# Altium schematic sheet RELAYS.SchDoc
size 594 x 420 mm
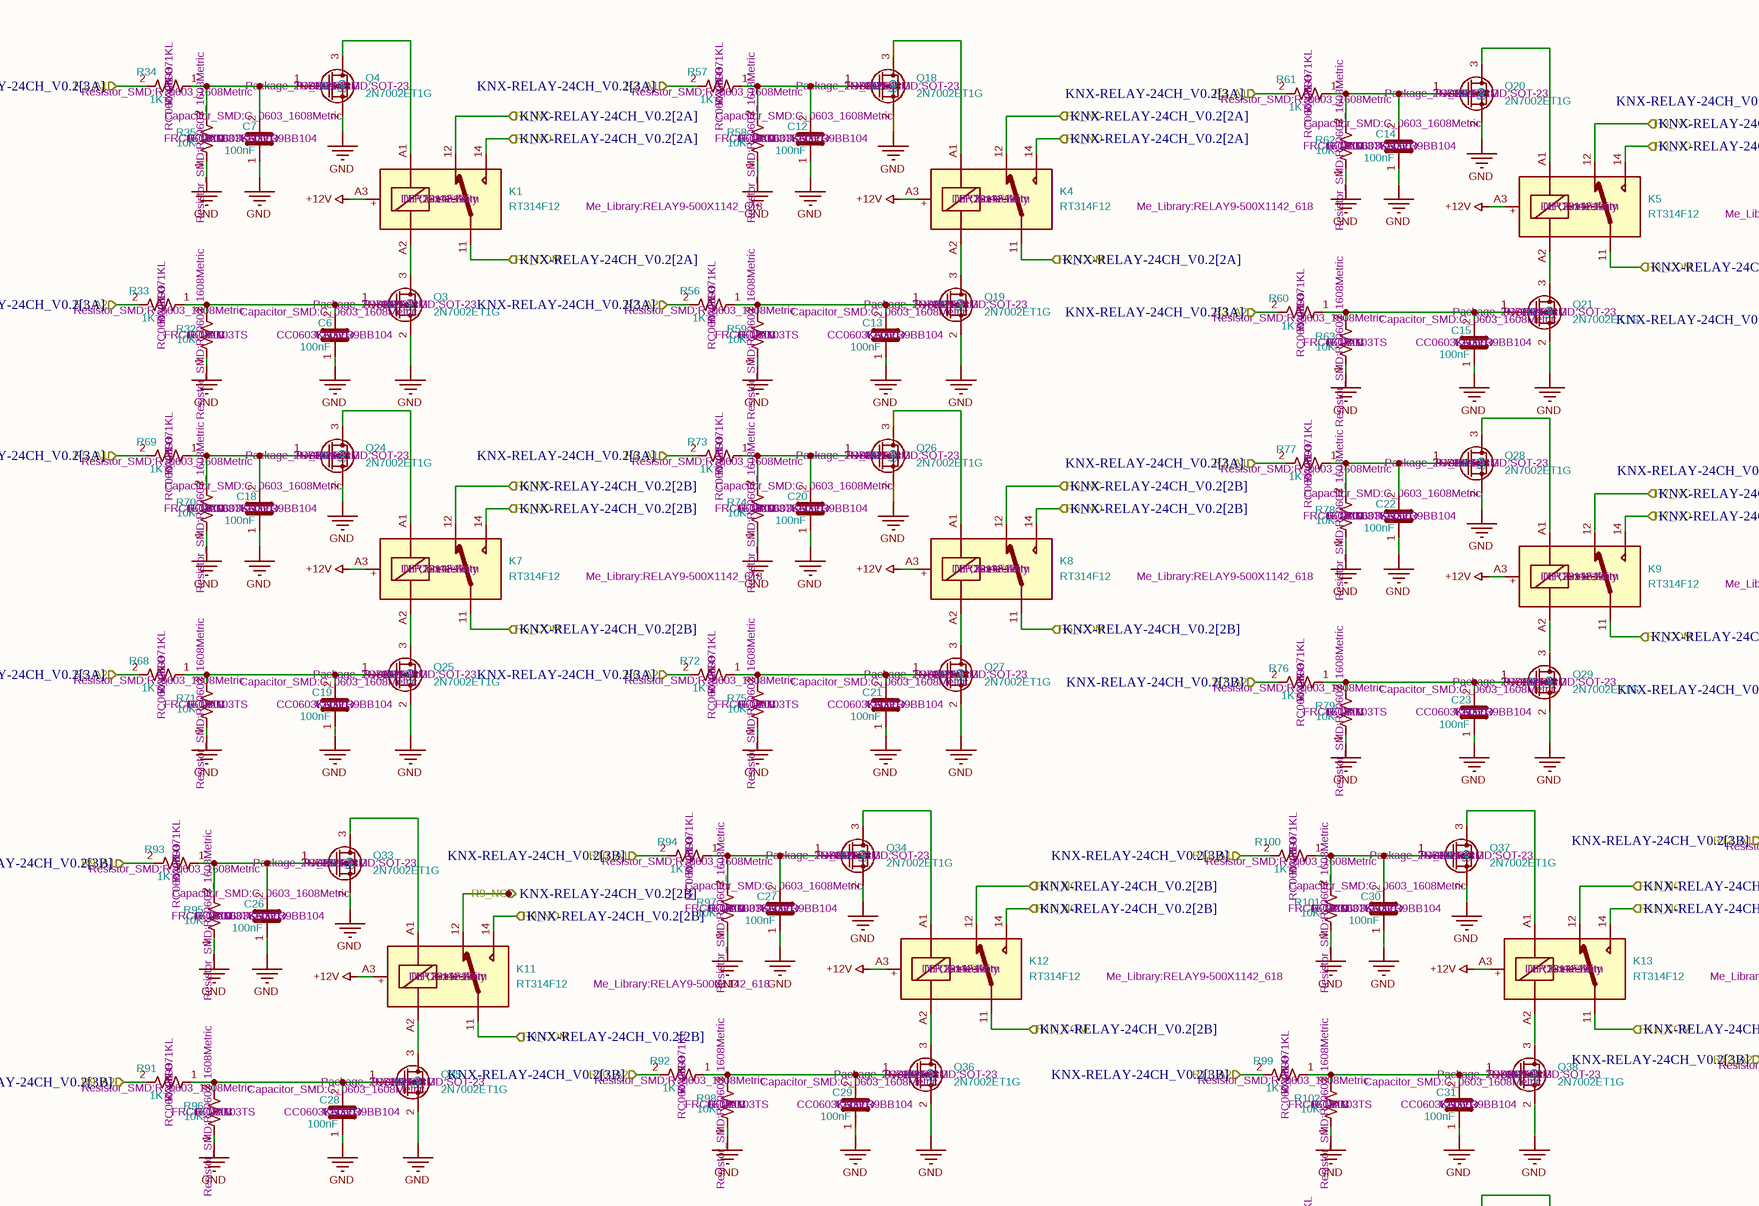
[diagram p0: RELAYS.SchDoc, top left]
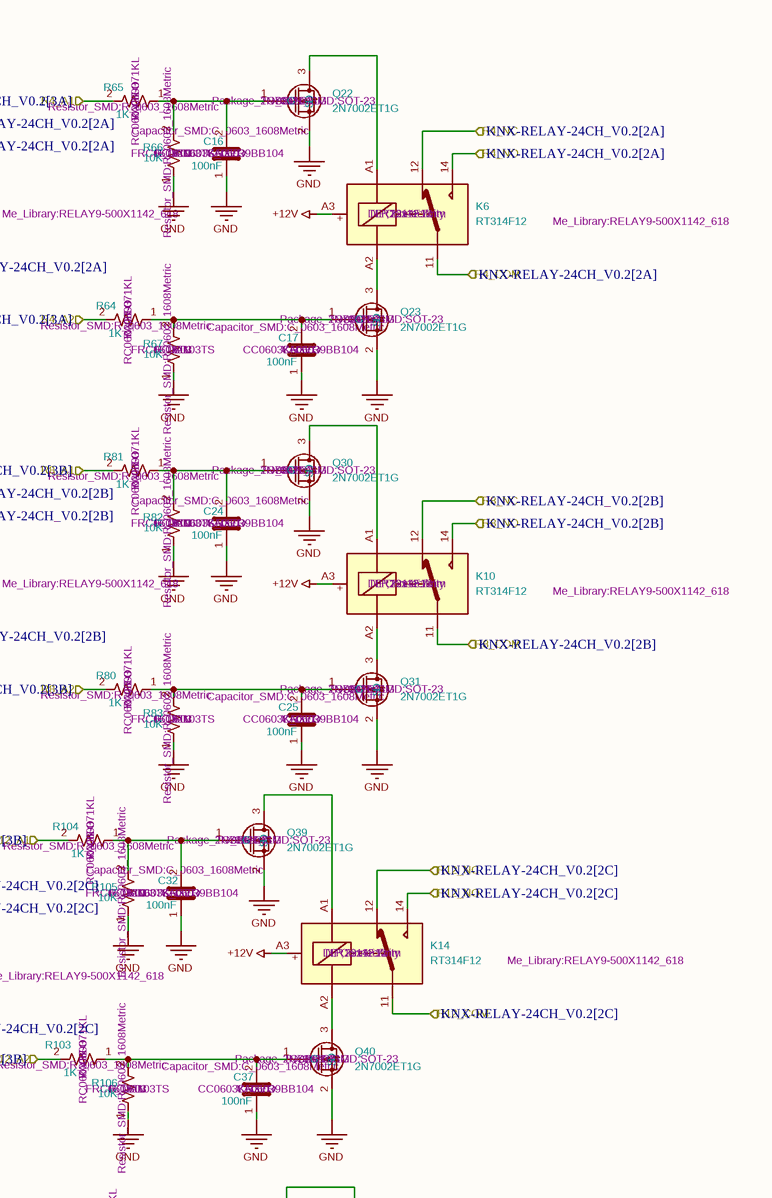
[diagram p1: RELAYS.SchDoc, top right]
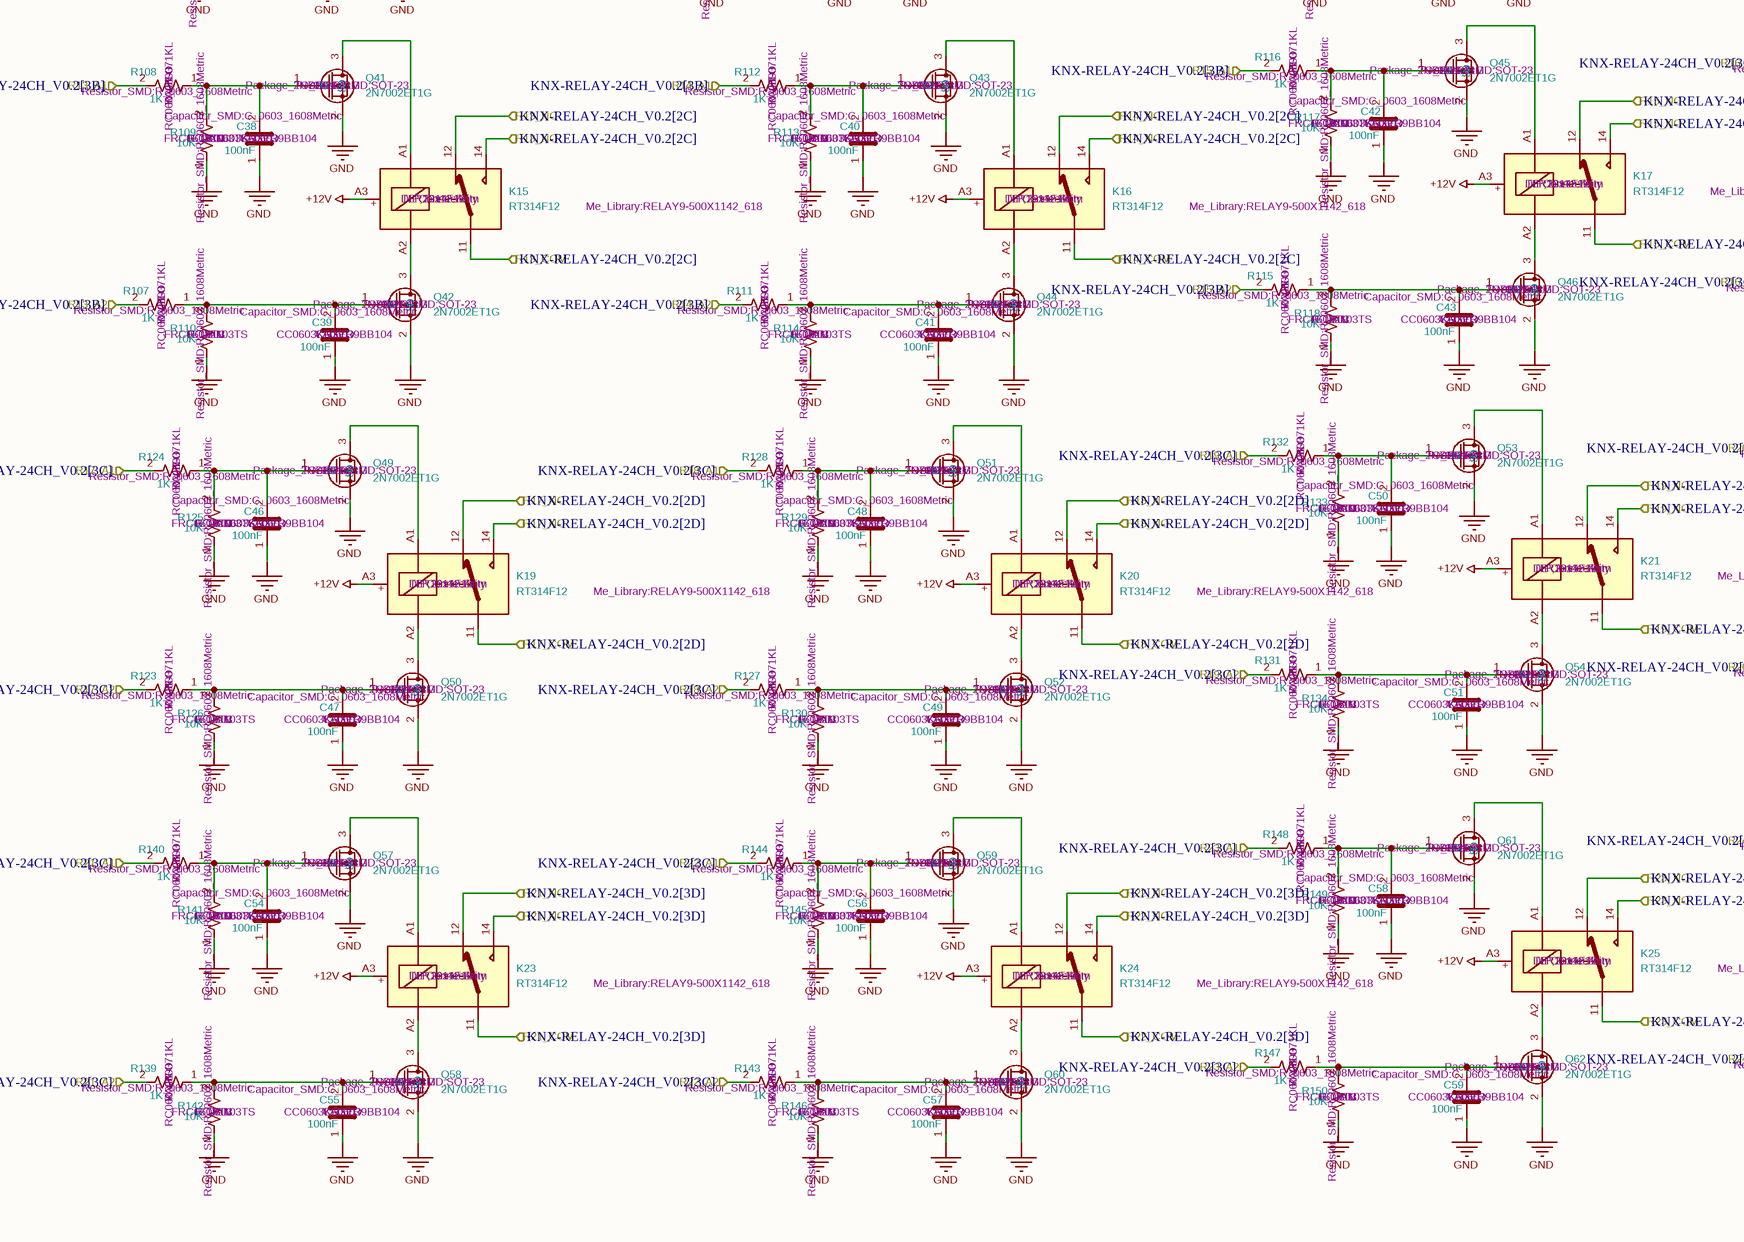
[diagram p2: RELAYS.SchDoc, bottom left]
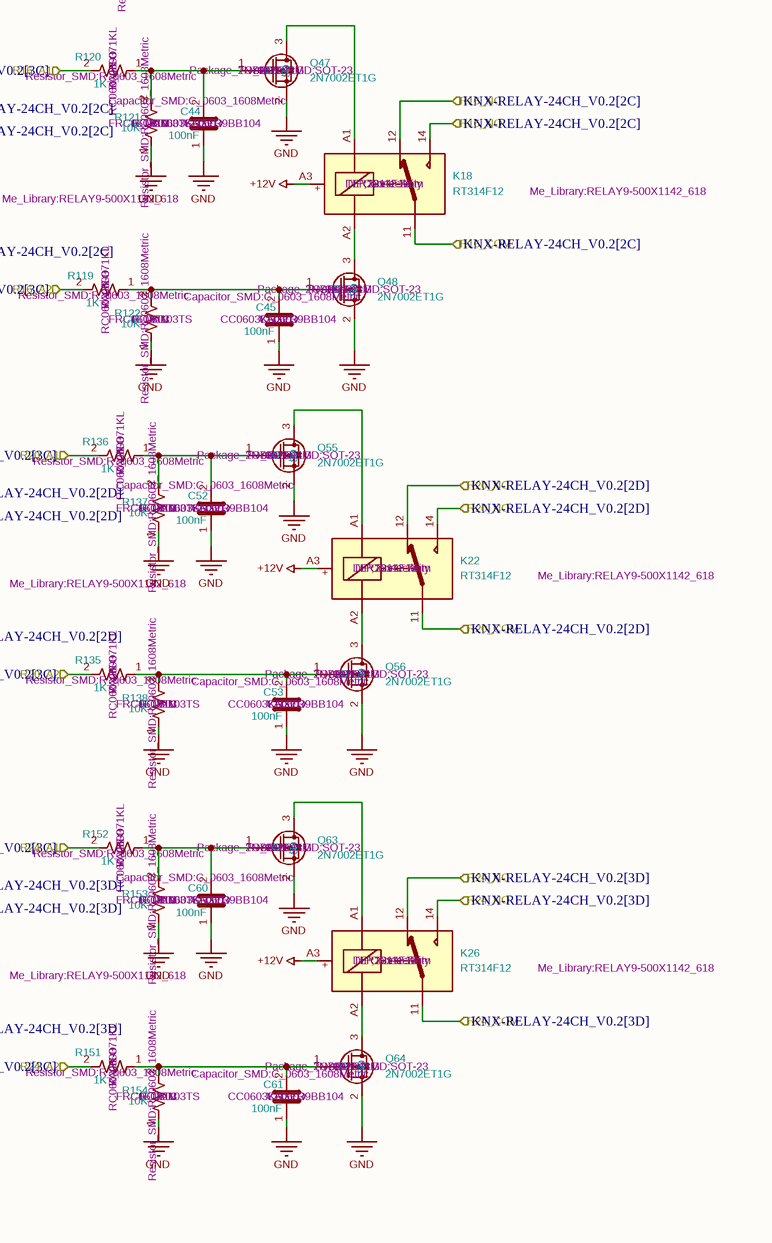
[diagram p3: RELAYS.SchDoc, bottom right]

## Parts
C6  Manufacturer Part Number: CC0603KRX7R9BB104  Manufacturer: YAGEO  Package: C_0603  Footprint: Capacitor_SMD:C_0603_1608Metric  [C_0603_1608Metric]  (hidden comment: 100nF)
C7  Manufacturer Part Number: CC0603KRX7R9BB104  Manufacturer: YAGEO  Package: C_0603  Footprint: Capacitor_SMD:C_0603_1608Metric  [C_0603_1608Metric]  (hidden comment: 100nF)
C12  Manufacturer Part Number: CC0603KRX7R9BB104  Manufacturer: YAGEO  Package: C_0603  Footprint: Capacitor_SMD:C_0603_1608Metric  [C_0603_1608Metric]  (hidden comment: 100nF)
C13  Manufacturer Part Number: CC0603KRX7R9BB104  Manufacturer: YAGEO  Package: C_0603  Footprint: Capacitor_SMD:C_0603_1608Metric  [C_0603_1608Metric]  (hidden comment: 100nF)
C14  Manufacturer Part Number: CC0603KRX7R9BB104  Manufacturer: YAGEO  Package: C_0603  Footprint: Capacitor_SMD:C_0603_1608Metric  [C_0603_1608Metric]  (hidden comment: 100nF)
C15  Manufacturer Part Number: CC0603KRX7R9BB104  Manufacturer: YAGEO  Package: C_0603  Footprint: Capacitor_SMD:C_0603_1608Metric  [C_0603_1608Metric]  (hidden comment: 100nF)
C16  Manufacturer Part Number: CC0603KRX7R9BB104  Manufacturer: YAGEO  Package: C_0603  Footprint: Capacitor_SMD:C_0603_1608Metric  [C_0603_1608Metric]  (hidden comment: 100nF)
C17  Manufacturer Part Number: CC0603KRX7R9BB104  Manufacturer: YAGEO  Package: C_0603  Footprint: Capacitor_SMD:C_0603_1608Metric  [C_0603_1608Metric]  (hidden comment: 100nF)
C18  Manufacturer Part Number: CC0603KRX7R9BB104  Manufacturer: YAGEO  Package: C_0603  Footprint: Capacitor_SMD:C_0603_1608Metric  [C_0603_1608Metric]  (hidden comment: 100nF)
C19  Manufacturer Part Number: CC0603KRX7R9BB104  Manufacturer: YAGEO  Package: C_0603  Footprint: Capacitor_SMD:C_0603_1608Metric  [C_0603_1608Metric]  (hidden comment: 100nF)
C20  Manufacturer Part Number: CC0603KRX7R9BB104  Manufacturer: YAGEO  Package: C_0603  Footprint: Capacitor_SMD:C_0603_1608Metric  [C_0603_1608Metric]  (hidden comment: 100nF)
C21  Manufacturer Part Number: CC0603KRX7R9BB104  Manufacturer: YAGEO  Package: C_0603  Footprint: Capacitor_SMD:C_0603_1608Metric  [C_0603_1608Metric]  (hidden comment: 100nF)
C22  Manufacturer Part Number: CC0603KRX7R9BB104  Manufacturer: YAGEO  Package: C_0603  Footprint: Capacitor_SMD:C_0603_1608Metric  [C_0603_1608Metric]  (hidden comment: 100nF)
C23  Manufacturer Part Number: CC0603KRX7R9BB104  Manufacturer: YAGEO  Package: C_0603  Footprint: Capacitor_SMD:C_0603_1608Metric  [C_0603_1608Metric]  (hidden comment: 100nF)
C24  Manufacturer Part Number: CC0603KRX7R9BB104  Manufacturer: YAGEO  Package: C_0603  Footprint: Capacitor_SMD:C_0603_1608Metric  [C_0603_1608Metric]  (hidden comment: 100nF)
C25  Manufacturer Part Number: CC0603KRX7R9BB104  Manufacturer: YAGEO  Package: C_0603  Footprint: Capacitor_SMD:C_0603_1608Metric  [C_0603_1608Metric]  (hidden comment: 100nF)
C26  Manufacturer Part Number: CC0603KRX7R9BB104  Manufacturer: YAGEO  Package: C_0603  Footprint: Capacitor_SMD:C_0603_1608Metric  [C_0603_1608Metric]  (hidden comment: 100nF)
C27  Manufacturer Part Number: CC0603KRX7R9BB104  Manufacturer: YAGEO  Package: C_0603  Footprint: Capacitor_SMD:C_0603_1608Metric  [C_0603_1608Metric]  (hidden comment: 100nF)
C28  Manufacturer Part Number: CC0603KRX7R9BB104  Manufacturer: YAGEO  Package: C_0603  Footprint: Capacitor_SMD:C_0603_1608Metric  [C_0603_1608Metric]  (hidden comment: 100nF)
C29  Manufacturer Part Number: CC0603KRX7R9BB104  Manufacturer: YAGEO  Package: C_0603  Footprint: Capacitor_SMD:C_0603_1608Metric  [C_0603_1608Metric]  (hidden comment: 100nF)
C30  Manufacturer Part Number: CC0603KRX7R9BB104  Manufacturer: YAGEO  Package: C_0603  Footprint: Capacitor_SMD:C_0603_1608Metric  [C_0603_1608Metric]  (hidden comment: 100nF)
C31  Manufacturer Part Number: CC0603KRX7R9BB104  Manufacturer: YAGEO  Package: C_0603  Footprint: Capacitor_SMD:C_0603_1608Metric  [C_0603_1608Metric]  (hidden comment: 100nF)
C32  Manufacturer Part Number: CC0603KRX7R9BB104  Manufacturer: YAGEO  Package: C_0603  Footprint: Capacitor_SMD:C_0603_1608Metric  [C_0603_1608Metric]  (hidden comment: 100nF)
C37  Manufacturer Part Number: CC0603KRX7R9BB104  Manufacturer: YAGEO  Package: C_0603  Footprint: Capacitor_SMD:C_0603_1608Metric  [C_0603_1608Metric]  (hidden comment: 100nF)
C38  Manufacturer Part Number: CC0603KRX7R9BB104  Manufacturer: YAGEO  Package: C_0603  Footprint: Capacitor_SMD:C_0603_1608Metric  [C_0603_1608Metric]  (hidden comment: 100nF)
C39  Manufacturer Part Number: CC0603KRX7R9BB104  Manufacturer: YAGEO  Package: C_0603  Footprint: Capacitor_SMD:C_0603_1608Metric  [C_0603_1608Metric]  (hidden comment: 100nF)
C40  Manufacturer Part Number: CC0603KRX7R9BB104  Manufacturer: YAGEO  Package: C_0603  Footprint: Capacitor_SMD:C_0603_1608Metric  [C_0603_1608Metric]  (hidden comment: 100nF)
C41  Manufacturer Part Number: CC0603KRX7R9BB104  Manufacturer: YAGEO  Package: C_0603  Footprint: Capacitor_SMD:C_0603_1608Metric  [C_0603_1608Metric]  (hidden comment: 100nF)
C42  Manufacturer Part Number: CC0603KRX7R9BB104  Manufacturer: YAGEO  Package: C_0603  Footprint: Capacitor_SMD:C_0603_1608Metric  [C_0603_1608Metric]  (hidden comment: 100nF)
C43  Manufacturer Part Number: CC0603KRX7R9BB104  Manufacturer: YAGEO  Package: C_0603  Footprint: Capacitor_SMD:C_0603_1608Metric  [C_0603_1608Metric]  (hidden comment: 100nF)
C44  Manufacturer Part Number: CC0603KRX7R9BB104  Manufacturer: YAGEO  Package: C_0603  Footprint: Capacitor_SMD:C_0603_1608Metric  [C_0603_1608Metric]  (hidden comment: 100nF)
C45  Manufacturer Part Number: CC0603KRX7R9BB104  Manufacturer: YAGEO  Package: C_0603  Footprint: Capacitor_SMD:C_0603_1608Metric  [C_0603_1608Metric]  (hidden comment: 100nF)
C46  Manufacturer Part Number: CC0603KRX7R9BB104  Manufacturer: YAGEO  Package: C_0603  Footprint: Capacitor_SMD:C_0603_1608Metric  [C_0603_1608Metric]  (hidden comment: 100nF)
C47  Manufacturer Part Number: CC0603KRX7R9BB104  Manufacturer: YAGEO  Package: C_0603  Footprint: Capacitor_SMD:C_0603_1608Metric  [C_0603_1608Metric]  (hidden comment: 100nF)
C48  Manufacturer Part Number: CC0603KRX7R9BB104  Manufacturer: YAGEO  Package: C_0603  Footprint: Capacitor_SMD:C_0603_1608Metric  [C_0603_1608Metric]  (hidden comment: 100nF)
C49  Manufacturer Part Number: CC0603KRX7R9BB104  Manufacturer: YAGEO  Package: C_0603  Footprint: Capacitor_SMD:C_0603_1608Metric  [C_0603_1608Metric]  (hidden comment: 100nF)
C50  Manufacturer Part Number: CC0603KRX7R9BB104  Manufacturer: YAGEO  Package: C_0603  Footprint: Capacitor_SMD:C_0603_1608Metric  [C_0603_1608Metric]  (hidden comment: 100nF)
C51  Manufacturer Part Number: CC0603KRX7R9BB104  Manufacturer: YAGEO  Package: C_0603  Footprint: Capacitor_SMD:C_0603_1608Metric  [C_0603_1608Metric]  (hidden comment: 100nF)
C52  Manufacturer Part Number: CC0603KRX7R9BB104  Manufacturer: YAGEO  Package: C_0603  Footprint: Capacitor_SMD:C_0603_1608Metric  [C_0603_1608Metric]  (hidden comment: 100nF)
C53  Manufacturer Part Number: CC0603KRX7R9BB104  Manufacturer: YAGEO  Package: C_0603  Footprint: Capacitor_SMD:C_0603_1608Metric  [C_0603_1608Metric]  (hidden comment: 100nF)
C54  Manufacturer Part Number: CC0603KRX7R9BB104  Manufacturer: YAGEO  Package: C_0603  Footprint: Capacitor_SMD:C_0603_1608Metric  [C_0603_1608Metric]  (hidden comment: 100nF)
C55  Manufacturer Part Number: CC0603KRX7R9BB104  Manufacturer: YAGEO  Package: C_0603  Footprint: Capacitor_SMD:C_0603_1608Metric  [C_0603_1608Metric]  (hidden comment: 100nF)
C56  Manufacturer Part Number: CC0603KRX7R9BB104  Manufacturer: YAGEO  Package: C_0603  Footprint: Capacitor_SMD:C_0603_1608Metric  [C_0603_1608Metric]  (hidden comment: 100nF)
C57  Manufacturer Part Number: CC0603KRX7R9BB104  Manufacturer: YAGEO  Package: C_0603  Footprint: Capacitor_SMD:C_0603_1608Metric  [C_0603_1608Metric]  (hidden comment: 100nF)
C58  Manufacturer Part Number: CC0603KRX7R9BB104  Manufacturer: YAGEO  Package: C_0603  Footprint: Capacitor_SMD:C_0603_1608Metric  [C_0603_1608Metric]  (hidden comment: 100nF)
C59  Manufacturer Part Number: CC0603KRX7R9BB104  Manufacturer: YAGEO  Package: C_0603  Footprint: Capacitor_SMD:C_0603_1608Metric  [C_0603_1608Metric]  (hidden comment: 100nF)
C60  Manufacturer Part Number: CC0603KRX7R9BB104  Manufacturer: YAGEO  Package: C_0603  Footprint: Capacitor_SMD:C_0603_1608Metric  [C_0603_1608Metric]  (hidden comment: 100nF)
C61  Manufacturer Part Number: CC0603KRX7R9BB104  Manufacturer: YAGEO  Package: C_0603  Footprint: Capacitor_SMD:C_0603_1608Metric  [C_0603_1608Metric]  (hidden comment: 100nF)
K1  Manufacturer: TE Connectivity  Package: DIP,29x12.7mm  Footprint: Me_Library:RELAY9-500X1142_618  [RELAY9-500X1142_618]  (hidden comment: RT314F12)
K4  Manufacturer: TE Connectivity  Package: DIP,29x12.7mm  Footprint: Me_Library:RELAY9-500X1142_618  [RELAY9-500X1142_618]  (hidden comment: RT314F12)
K5  Manufacturer: TE Connectivity  Package: DIP,29x12.7mm  Footprint: Me_Library:RELAY9-500X1142_618  [RELAY9-500X1142_618]  (hidden comment: RT314F12)
K6  Manufacturer: TE Connectivity  Package: DIP,29x12.7mm  Footprint: Me_Library:RELAY9-500X1142_618  [RELAY9-500X1142_618]  (hidden comment: RT314F12)
K7  Manufacturer: TE Connectivity  Package: DIP,29x12.7mm  Footprint: Me_Library:RELAY9-500X1142_618  [RELAY9-500X1142_618]  (hidden comment: RT314F12)
K8  Manufacturer: TE Connectivity  Package: DIP,29x12.7mm  Footprint: Me_Library:RELAY9-500X1142_618  [RELAY9-500X1142_618]  (hidden comment: RT314F12)
K9  Manufacturer: TE Connectivity  Package: DIP,29x12.7mm  Footprint: Me_Library:RELAY9-500X1142_618  [RELAY9-500X1142_618]  (hidden comment: RT314F12)
K10  Manufacturer: TE Connectivity  Package: DIP,29x12.7mm  Footprint: Me_Library:RELAY9-500X1142_618  [RELAY9-500X1142_618]  (hidden comment: RT314F12)
K11  Manufacturer: TE Connectivity  Package: DIP,29x12.7mm  Footprint: Me_Library:RELAY9-500X1142_618  [RELAY9-500X1142_618]  (hidden comment: RT314F12)
K12  Manufacturer: TE Connectivity  Package: DIP,29x12.7mm  Footprint: Me_Library:RELAY9-500X1142_618  [RELAY9-500X1142_618]  (hidden comment: RT314F12)
K13  Manufacturer: TE Connectivity  Package: DIP,29x12.7mm  Footprint: Me_Library:RELAY9-500X1142_618  [RELAY9-500X1142_618]  (hidden comment: RT314F12)
K14  Manufacturer: TE Connectivity  Package: DIP,29x12.7mm  Footprint: Me_Library:RELAY9-500X1142_618  [RELAY9-500X1142_618]  (hidden comment: RT314F12)
K15  Manufacturer: TE Connectivity  Package: DIP,29x12.7mm  Footprint: Me_Library:RELAY9-500X1142_618  [RELAY9-500X1142_618]  (hidden comment: RT314F12)
K16  Manufacturer: TE Connectivity  Package: DIP,29x12.7mm  Footprint: Me_Library:RELAY9-500X1142_618  [RELAY9-500X1142_618]  (hidden comment: RT314F12)
K17  Manufacturer: TE Connectivity  Package: DIP,29x12.7mm  Footprint: Me_Library:RELAY9-500X1142_618  [RELAY9-500X1142_618]  (hidden comment: RT314F12)
K18  Manufacturer: TE Connectivity  Package: DIP,29x12.7mm  Footprint: Me_Library:RELAY9-500X1142_618  [RELAY9-500X1142_618]  (hidden comment: RT314F12)
K19  Manufacturer: TE Connectivity  Package: DIP,29x12.7mm  Footprint: Me_Library:RELAY9-500X1142_618  [RELAY9-500X1142_618]  (hidden comment: RT314F12)
K20  Manufacturer: TE Connectivity  Package: DIP,29x12.7mm  Footprint: Me_Library:RELAY9-500X1142_618  [RELAY9-500X1142_618]  (hidden comment: RT314F12)
K21  Manufacturer: TE Connectivity  Package: DIP,29x12.7mm  Footprint: Me_Library:RELAY9-500X1142_618  [RELAY9-500X1142_618]  (hidden comment: RT314F12)
K22  Manufacturer: TE Connectivity  Package: DIP,29x12.7mm  Footprint: Me_Library:RELAY9-500X1142_618  [RELAY9-500X1142_618]  (hidden comment: RT314F12)
K23  Manufacturer: TE Connectivity  Package: DIP,29x12.7mm  Footprint: Me_Library:RELAY9-500X1142_618  [RELAY9-500X1142_618]  (hidden comment: RT314F12)
K24  Manufacturer: TE Connectivity  Package: DIP,29x12.7mm  Footprint: Me_Library:RELAY9-500X1142_618  [RELAY9-500X1142_618]  (hidden comment: RT314F12)
K25  Manufacturer: TE Connectivity  Package: DIP,29x12.7mm  Footprint: Me_Library:RELAY9-500X1142_618  [RELAY9-500X1142_618]  (hidden comment: RT314F12)
K26  Manufacturer: TE Connectivity  Package: DIP,29x12.7mm  Footprint: Me_Library:RELAY9-500X1142_618  [RELAY9-500X1142_618]  (hidden comment: RT314F12)
Q3  Manufacturer: onsemi  Footprint: Package_TO_SOT_SMD:SOT-23  [SOT-23]  (hidden comment: 2N7002ET1G)
Q4  Manufacturer: onsemi  Footprint: Package_TO_SOT_SMD:SOT-23  [SOT-23]  (hidden comment: 2N7002ET1G)
Q18  Manufacturer: onsemi  Footprint: Package_TO_SOT_SMD:SOT-23  [SOT-23]  (hidden comment: 2N7002ET1G)
Q19  Manufacturer: onsemi  Footprint: Package_TO_SOT_SMD:SOT-23  [SOT-23]  (hidden comment: 2N7002ET1G)
Q20  Manufacturer: onsemi  Footprint: Package_TO_SOT_SMD:SOT-23  [SOT-23]  (hidden comment: 2N7002ET1G)
Q21  Manufacturer: onsemi  Footprint: Package_TO_SOT_SMD:SOT-23  [SOT-23]  (hidden comment: 2N7002ET1G)
Q22  Manufacturer: onsemi  Footprint: Package_TO_SOT_SMD:SOT-23  [SOT-23]  (hidden comment: 2N7002ET1G)
Q23  Manufacturer: onsemi  Footprint: Package_TO_SOT_SMD:SOT-23  [SOT-23]  (hidden comment: 2N7002ET1G)
Q24  Manufacturer: onsemi  Footprint: Package_TO_SOT_SMD:SOT-23  [SOT-23]  (hidden comment: 2N7002ET1G)
Q25  Manufacturer: onsemi  Footprint: Package_TO_SOT_SMD:SOT-23  [SOT-23]  (hidden comment: 2N7002ET1G)
Q26  Manufacturer: onsemi  Footprint: Package_TO_SOT_SMD:SOT-23  [SOT-23]  (hidden comment: 2N7002ET1G)
Q27  Manufacturer: onsemi  Footprint: Package_TO_SOT_SMD:SOT-23  [SOT-23]  (hidden comment: 2N7002ET1G)
Q28  Manufacturer: onsemi  Footprint: Package_TO_SOT_SMD:SOT-23  [SOT-23]  (hidden comment: 2N7002ET1G)
Q29  Manufacturer: onsemi  Footprint: Package_TO_SOT_SMD:SOT-23  [SOT-23]  (hidden comment: 2N7002ET1G)
Q30  Manufacturer: onsemi  Footprint: Package_TO_SOT_SMD:SOT-23  [SOT-23]  (hidden comment: 2N7002ET1G)
Q31  Manufacturer: onsemi  Footprint: Package_TO_SOT_SMD:SOT-23  [SOT-23]  (hidden comment: 2N7002ET1G)
Q33  Manufacturer: onsemi  Footprint: Package_TO_SOT_SMD:SOT-23  [SOT-23]  (hidden comment: 2N7002ET1G)
Q34  Manufacturer: onsemi  Footprint: Package_TO_SOT_SMD:SOT-23  [SOT-23]  (hidden comment: 2N7002ET1G)
Q35  Manufacturer: onsemi  Footprint: Package_TO_SOT_SMD:SOT-23  [SOT-23]  (hidden comment: 2N7002ET1G)
Q36  Manufacturer: onsemi  Footprint: Package_TO_SOT_SMD:SOT-23  [SOT-23]  (hidden comment: 2N7002ET1G)
Q37  Manufacturer: onsemi  Footprint: Package_TO_SOT_SMD:SOT-23  [SOT-23]  (hidden comment: 2N7002ET1G)
Q38  Manufacturer: onsemi  Footprint: Package_TO_SOT_SMD:SOT-23  [SOT-23]  (hidden comment: 2N7002ET1G)
Q39  Manufacturer: onsemi  Footprint: Package_TO_SOT_SMD:SOT-23  [SOT-23]  (hidden comment: 2N7002ET1G)
Q40  Manufacturer: onsemi  Footprint: Package_TO_SOT_SMD:SOT-23  [SOT-23]  (hidden comment: 2N7002ET1G)
Q41  Manufacturer: onsemi  Footprint: Package_TO_SOT_SMD:SOT-23  [SOT-23]  (hidden comment: 2N7002ET1G)
Q42  Manufacturer: onsemi  Footprint: Package_TO_SOT_SMD:SOT-23  [SOT-23]  (hidden comment: 2N7002ET1G)
Q43  Manufacturer: onsemi  Footprint: Package_TO_SOT_SMD:SOT-23  [SOT-23]  (hidden comment: 2N7002ET1G)
Q44  Manufacturer: onsemi  Footprint: Package_TO_SOT_SMD:SOT-23  [SOT-23]  (hidden comment: 2N7002ET1G)
Q45  Manufacturer: onsemi  Footprint: Package_TO_SOT_SMD:SOT-23  [SOT-23]  (hidden comment: 2N7002ET1G)
Q46  Manufacturer: onsemi  Footprint: Package_TO_SOT_SMD:SOT-23  [SOT-23]  (hidden comment: 2N7002ET1G)
Q47  Manufacturer: onsemi  Footprint: Package_TO_SOT_SMD:SOT-23  [SOT-23]  (hidden comment: 2N7002ET1G)
Q48  Manufacturer: onsemi  Footprint: Package_TO_SOT_SMD:SOT-23  [SOT-23]  (hidden comment: 2N7002ET1G)
Q49  Manufacturer: onsemi  Footprint: Package_TO_SOT_SMD:SOT-23  [SOT-23]  (hidden comment: 2N7002ET1G)
Q50  Manufacturer: onsemi  Footprint: Package_TO_SOT_SMD:SOT-23  [SOT-23]  (hidden comment: 2N7002ET1G)
Q51  Manufacturer: onsemi  Footprint: Package_TO_SOT_SMD:SOT-23  [SOT-23]  (hidden comment: 2N7002ET1G)
Q52  Manufacturer: onsemi  Footprint: Package_TO_SOT_SMD:SOT-23  [SOT-23]  (hidden comment: 2N7002ET1G)
Q53  Manufacturer: onsemi  Footprint: Package_TO_SOT_SMD:SOT-23  [SOT-23]  (hidden comment: 2N7002ET1G)
Q54  Manufacturer: onsemi  Footprint: Package_TO_SOT_SMD:SOT-23  [SOT-23]  (hidden comment: 2N7002ET1G)
Q55  Manufacturer: onsemi  Footprint: Package_TO_SOT_SMD:SOT-23  [SOT-23]  (hidden comment: 2N7002ET1G)
Q56  Manufacturer: onsemi  Footprint: Package_TO_SOT_SMD:SOT-23  [SOT-23]  (hidden comment: 2N7002ET1G)
Q57  Manufacturer: onsemi  Footprint: Package_TO_SOT_SMD:SOT-23  [SOT-23]  (hidden comment: 2N7002ET1G)
Q58  Manufacturer: onsemi  Footprint: Package_TO_SOT_SMD:SOT-23  [SOT-23]  (hidden comment: 2N7002ET1G)
Q59  Manufacturer: onsemi  Footprint: Package_TO_SOT_SMD:SOT-23  [SOT-23]  (hidden comment: 2N7002ET1G)
Q60  Manufacturer: onsemi  Footprint: Package_TO_SOT_SMD:SOT-23  [SOT-23]  (hidden comment: 2N7002ET1G)
Q61  Manufacturer: onsemi  Footprint: Package_TO_SOT_SMD:SOT-23  [SOT-23]  (hidden comment: 2N7002ET1G)
Q62  Manufacturer: onsemi  Footprint: Package_TO_SOT_SMD:SOT-23  [SOT-23]  (hidden comment: 2N7002ET1G)
Q63  Manufacturer: onsemi  Footprint: Package_TO_SOT_SMD:SOT-23  [SOT-23]  (hidden comment: 2N7002ET1G)
Q64  Manufacturer: onsemi  Footprint: Package_TO_SOT_SMD:SOT-23  [SOT-23]  (hidden comment: 2N7002ET1G)
R32  Manufacturer Part Number: FRC0603J103TS  Manufacturer: FOJAN  Package: R_0603  Footprint: Resistor_SMD:R_0603_1608Metric  [R_0603_1608Metric]  (hidden comment: 10K)
R33  Manufacturer Part Number: RC0603JR-071KL  Manufacturer: YAGEO  Package: R_0603  Footprint: Resistor_SMD:R_0603_1608Metric  [R_0603_1608Metric]  (hidden comment: 1K)
R34  Manufacturer Part Number: RC0603JR-071KL  Manufacturer: YAGEO  Package: R_0603  Footprint: Resistor_SMD:R_0603_1608Metric  [R_0603_1608Metric]  (hidden comment: 1K)
R35  Manufacturer Part Number: FRC0603J103TS  Manufacturer: FOJAN  Package: R_0603  Footprint: Resistor_SMD:R_0603_1608Metric  [R_0603_1608Metric]  (hidden comment: 10K)
R56  Manufacturer Part Number: RC0603JR-071KL  Manufacturer: YAGEO  Package: R_0603  Footprint: Resistor_SMD:R_0603_1608Metric  [R_0603_1608Metric]  (hidden comment: 1K)
R57  Manufacturer Part Number: RC0603JR-071KL  Manufacturer: YAGEO  Package: R_0603  Footprint: Resistor_SMD:R_0603_1608Metric  [R_0603_1608Metric]  (hidden comment: 1K)
R58  Manufacturer Part Number: FRC0603J103TS  Manufacturer: FOJAN  Package: R_0603  Footprint: Resistor_SMD:R_0603_1608Metric  [R_0603_1608Metric]  (hidden comment: 10K)
R59  Manufacturer Part Number: FRC0603J103TS  Manufacturer: FOJAN  Package: R_0603  Footprint: Resistor_SMD:R_0603_1608Metric  [R_0603_1608Metric]  (hidden comment: 10K)
R60  Manufacturer Part Number: RC0603JR-071KL  Manufacturer: YAGEO  Package: R_0603  Footprint: Resistor_SMD:R_0603_1608Metric  [R_0603_1608Metric]  (hidden comment: 1K)
R61  Manufacturer Part Number: RC0603JR-071KL  Manufacturer: YAGEO  Package: R_0603  Footprint: Resistor_SMD:R_0603_1608Metric  [R_0603_1608Metric]  (hidden comment: 1K)
R62  Manufacturer Part Number: FRC0603J103TS  Manufacturer: FOJAN  Package: R_0603  Footprint: Resistor_SMD:R_0603_1608Metric  [R_0603_1608Metric]  (hidden comment: 10K)
R63  Manufacturer Part Number: FRC0603J103TS  Manufacturer: FOJAN  Package: R_0603  Footprint: Resistor_SMD:R_0603_1608Metric  [R_0603_1608Metric]  (hidden comment: 10K)
R64  Manufacturer Part Number: RC0603JR-071KL  Manufacturer: YAGEO  Package: R_0603  Footprint: Resistor_SMD:R_0603_1608Metric  [R_0603_1608Metric]  (hidden comment: 1K)
R65  Manufacturer Part Number: RC0603JR-071KL  Manufacturer: YAGEO  Package: R_0603  Footprint: Resistor_SMD:R_0603_1608Metric  [R_0603_1608Metric]  (hidden comment: 1K)
R66  Manufacturer Part Number: FRC0603J103TS  Manufacturer: FOJAN  Package: R_0603  Footprint: Resistor_SMD:R_0603_1608Metric  [R_0603_1608Metric]  (hidden comment: 10K)
R67  Manufacturer Part Number: FRC0603J103TS  Manufacturer: FOJAN  Package: R_0603  Footprint: Resistor_SMD:R_0603_1608Metric  [R_0603_1608Metric]  (hidden comment: 10K)
R68  Manufacturer Part Number: RC0603JR-071KL  Manufacturer: YAGEO  Package: R_0603  Footprint: Resistor_SMD:R_0603_1608Metric  [R_0603_1608Metric]  (hidden comment: 1K)
R69  Manufacturer Part Number: RC0603JR-071KL  Manufacturer: YAGEO  Package: R_0603  Footprint: Resistor_SMD:R_0603_1608Metric  [R_0603_1608Metric]  (hidden comment: 1K)
R70  Manufacturer Part Number: FRC0603J103TS  Manufacturer: FOJAN  Package: R_0603  Footprint: Resistor_SMD:R_0603_1608Metric  [R_0603_1608Metric]  (hidden comment: 10K)
R71  Manufacturer Part Number: FRC0603J103TS  Manufacturer: FOJAN  Package: R_0603  Footprint: Resistor_SMD:R_0603_1608Metric  [R_0603_1608Metric]  (hidden comment: 10K)
R72  Manufacturer Part Number: RC0603JR-071KL  Manufacturer: YAGEO  Package: R_0603  Footprint: Resistor_SMD:R_0603_1608Metric  [R_0603_1608Metric]  (hidden comment: 1K)
R73  Manufacturer Part Number: RC0603JR-071KL  Manufacturer: YAGEO  Package: R_0603  Footprint: Resistor_SMD:R_0603_1608Metric  [R_0603_1608Metric]  (hidden comment: 1K)
R74  Manufacturer Part Number: FRC0603J103TS  Manufacturer: FOJAN  Package: R_0603  Footprint: Resistor_SMD:R_0603_1608Metric  [R_0603_1608Metric]  (hidden comment: 10K)
R75  Manufacturer Part Number: FRC0603J103TS  Manufacturer: FOJAN  Package: R_0603  Footprint: Resistor_SMD:R_0603_1608Metric  [R_0603_1608Metric]  (hidden comment: 10K)
R76  Manufacturer Part Number: RC0603JR-071KL  Manufacturer: YAGEO  Package: R_0603  Footprint: Resistor_SMD:R_0603_1608Metric  [R_0603_1608Metric]  (hidden comment: 1K)
R77  Manufacturer Part Number: RC0603JR-071KL  Manufacturer: YAGEO  Package: R_0603  Footprint: Resistor_SMD:R_0603_1608Metric  [R_0603_1608Metric]  (hidden comment: 1K)
R78  Manufacturer Part Number: FRC0603J103TS  Manufacturer: FOJAN  Package: R_0603  Footprint: Resistor_SMD:R_0603_1608Metric  [R_0603_1608Metric]  (hidden comment: 10K)
R79  Manufacturer Part Number: FRC0603J103TS  Manufacturer: FOJAN  Package: R_0603  Footprint: Resistor_SMD:R_0603_1608Metric  [R_0603_1608Metric]  (hidden comment: 10K)
R80  Manufacturer Part Number: RC0603JR-071KL  Manufacturer: YAGEO  Package: R_0603  Footprint: Resistor_SMD:R_0603_1608Metric  [R_0603_1608Metric]  (hidden comment: 1K)
R81  Manufacturer Part Number: RC0603JR-071KL  Manufacturer: YAGEO  Package: R_0603  Footprint: Resistor_SMD:R_0603_1608Metric  [R_0603_1608Metric]  (hidden comment: 1K)
R82  Manufacturer Part Number: FRC0603J103TS  Manufacturer: FOJAN  Package: R_0603  Footprint: Resistor_SMD:R_0603_1608Metric  [R_0603_1608Metric]  (hidden comment: 10K)
R83  Manufacturer Part Number: FRC0603J103TS  Manufacturer: FOJAN  Package: R_0603  Footprint: Resistor_SMD:R_0603_1608Metric  [R_0603_1608Metric]  (hidden comment: 10K)
R91  Manufacturer Part Number: RC0603JR-071KL  Manufacturer: YAGEO  Package: R_0603  Footprint: Resistor_SMD:R_0603_1608Metric  [R_0603_1608Metric]  (hidden comment: 1K)
R92  Manufacturer Part Number: RC0603JR-071KL  Manufacturer: YAGEO  Package: R_0603  Footprint: Resistor_SMD:R_0603_1608Metric  [R_0603_1608Metric]  (hidden comment: 1K)
R93  Manufacturer Part Number: RC0603JR-071KL  Manufacturer: YAGEO  Package: R_0603  Footprint: Resistor_SMD:R_0603_1608Metric  [R_0603_1608Metric]  (hidden comment: 1K)
R94  Manufacturer Part Number: RC0603JR-071KL  Manufacturer: YAGEO  Package: R_0603  Footprint: Resistor_SMD:R_0603_1608Metric  [R_0603_1608Metric]  (hidden comment: 1K)
R95  Manufacturer Part Number: FRC0603J103TS  Manufacturer: FOJAN  Package: R_0603  Footprint: Resistor_SMD:R_0603_1608Metric  [R_0603_1608Metric]  (hidden comment: 10K)
R96  Manufacturer Part Number: FRC0603J103TS  Manufacturer: FOJAN  Package: R_0603  Footprint: Resistor_SMD:R_0603_1608Metric  [R_0603_1608Metric]  (hidden comment: 10K)
R97  Manufacturer Part Number: FRC0603J103TS  Manufacturer: FOJAN  Package: R_0603  Footprint: Resistor_SMD:R_0603_1608Metric  [R_0603_1608Metric]  (hidden comment: 10K)
R98  Manufacturer Part Number: FRC0603J103TS  Manufacturer: FOJAN  Package: R_0603  Footprint: Resistor_SMD:R_0603_1608Metric  [R_0603_1608Metric]  (hidden comment: 10K)
R99  Manufacturer Part Number: RC0603JR-071KL  Manufacturer: YAGEO  Package: R_0603  Footprint: Resistor_SMD:R_0603_1608Metric  [R_0603_1608Metric]  (hidden comment: 1K)
R100  Manufacturer Part Number: RC0603JR-071KL  Manufacturer: YAGEO  Package: R_0603  Footprint: Resistor_SMD:R_0603_1608Metric  [R_0603_1608Metric]  (hidden comment: 1K)
R101  Manufacturer Part Number: FRC0603J103TS  Manufacturer: FOJAN  Package: R_0603  Footprint: Resistor_SMD:R_0603_1608Metric  [R_0603_1608Metric]  (hidden comment: 10K)
R102  Manufacturer Part Number: FRC0603J103TS  Manufacturer: FOJAN  Package: R_0603  Footprint: Resistor_SMD:R_0603_1608Metric  [R_0603_1608Metric]  (hidden comment: 10K)
R103  Manufacturer Part Number: RC0603JR-071KL  Manufacturer: YAGEO  Package: R_0603  Footprint: Resistor_SMD:R_0603_1608Metric  [R_0603_1608Metric]  (hidden comment: 1K)
R104  Manufacturer Part Number: RC0603JR-071KL  Manufacturer: YAGEO  Package: R_0603  Footprint: Resistor_SMD:R_0603_1608Metric  [R_0603_1608Metric]  (hidden comment: 1K)
R105  Manufacturer Part Number: FRC0603J103TS  Manufacturer: FOJAN  Package: R_0603  Footprint: Resistor_SMD:R_0603_1608Metric  [R_0603_1608Metric]  (hidden comment: 10K)
R106  Manufacturer Part Number: FRC0603J103TS  Manufacturer: FOJAN  Package: R_0603  Footprint: Resistor_SMD:R_0603_1608Metric  [R_0603_1608Metric]  (hidden comment: 10K)
R107  Manufacturer Part Number: RC0603JR-071KL  Manufacturer: YAGEO  Package: R_0603  Footprint: Resistor_SMD:R_0603_1608Metric  [R_0603_1608Metric]  (hidden comment: 1K)
R108  Manufacturer Part Number: RC0603JR-071KL  Manufacturer: YAGEO  Package: R_0603  Footprint: Resistor_SMD:R_0603_1608Metric  [R_0603_1608Metric]  (hidden comment: 1K)
R109  Manufacturer Part Number: FRC0603J103TS  Manufacturer: FOJAN  Package: R_0603  Footprint: Resistor_SMD:R_0603_1608Metric  [R_0603_1608Metric]  (hidden comment: 10K)
R110  Manufacturer Part Number: FRC0603J103TS  Manufacturer: FOJAN  Package: R_0603  Footprint: Resistor_SMD:R_0603_1608Metric  [R_0603_1608Metric]  (hidden comment: 10K)
R111  Manufacturer Part Number: RC0603JR-071KL  Manufacturer: YAGEO  Package: R_0603  Footprint: Resistor_SMD:R_0603_1608Metric  [R_0603_1608Metric]  (hidden comment: 1K)
R112  Manufacturer Part Number: RC0603JR-071KL  Manufacturer: YAGEO  Package: R_0603  Footprint: Resistor_SMD:R_0603_1608Metric  [R_0603_1608Metric]  (hidden comment: 1K)
R113  Manufacturer Part Number: FRC0603J103TS  Manufacturer: FOJAN  Package: R_0603  Footprint: Resistor_SMD:R_0603_1608Metric  [R_0603_1608Metric]  (hidden comment: 10K)
R114  Manufacturer Part Number: FRC0603J103TS  Manufacturer: FOJAN  Package: R_0603  Footprint: Resistor_SMD:R_0603_1608Metric  [R_0603_1608Metric]  (hidden comment: 10K)
R115  Manufacturer Part Number: RC0603JR-071KL  Manufacturer: YAGEO  Package: R_0603  Footprint: Resistor_SMD:R_0603_1608Metric  [R_0603_1608Metric]  (hidden comment: 1K)
R116  Manufacturer Part Number: RC0603JR-071KL  Manufacturer: YAGEO  Package: R_0603  Footprint: Resistor_SMD:R_0603_1608Metric  [R_0603_1608Metric]  (hidden comment: 1K)
R117  Manufacturer Part Number: FRC0603J103TS  Manufacturer: FOJAN  Package: R_0603  Footprint: Resistor_SMD:R_0603_1608Metric  [R_0603_1608Metric]  (hidden comment: 10K)
R118  Manufacturer Part Number: FRC0603J103TS  Manufacturer: FOJAN  Package: R_0603  Footprint: Resistor_SMD:R_0603_1608Metric  [R_0603_1608Metric]  (hidden comment: 10K)
R119  Manufacturer Part Number: RC0603JR-071KL  Manufacturer: YAGEO  Package: R_0603  Footprint: Resistor_SMD:R_0603_1608Metric  [R_0603_1608Metric]  (hidden comment: 1K)
R120  Manufacturer Part Number: RC0603JR-071KL  Manufacturer: YAGEO  Package: R_0603  Footprint: Resistor_SMD:R_0603_1608Metric  [R_0603_1608Metric]  (hidden comment: 1K)
R121  Manufacturer Part Number: FRC0603J103TS  Manufacturer: FOJAN  Package: R_0603  Footprint: Resistor_SMD:R_0603_1608Metric  [R_0603_1608Metric]  (hidden comment: 10K)
R122  Manufacturer Part Number: FRC0603J103TS  Manufacturer: FOJAN  Package: R_0603  Footprint: Resistor_SMD:R_0603_1608Metric  [R_0603_1608Metric]  (hidden comment: 10K)
R123  Manufacturer Part Number: RC0603JR-071KL  Manufacturer: YAGEO  Package: R_0603  Footprint: Resistor_SMD:R_0603_1608Metric  [R_0603_1608Metric]  (hidden comment: 1K)
R124  Manufacturer Part Number: RC0603JR-071KL  Manufacturer: YAGEO  Package: R_0603  Footprint: Resistor_SMD:R_0603_1608Metric  [R_0603_1608Metric]  (hidden comment: 1K)
R125  Manufacturer Part Number: FRC0603J103TS  Manufacturer: FOJAN  Package: R_0603  Footprint: Resistor_SMD:R_0603_1608Metric  [R_0603_1608Metric]  (hidden comment: 10K)
R126  Manufacturer Part Number: FRC0603J103TS  Manufacturer: FOJAN  Package: R_0603  Footprint: Resistor_SMD:R_0603_1608Metric  [R_0603_1608Metric]  (hidden comment: 10K)
R127  Manufacturer Part Number: RC0603JR-071KL  Manufacturer: YAGEO  Package: R_0603  Footprint: Resistor_SMD:R_0603_1608Metric  [R_0603_1608Metric]  (hidden comment: 1K)
R128  Manufacturer Part Number: RC0603JR-071KL  Manufacturer: YAGEO  Package: R_0603  Footprint: Resistor_SMD:R_0603_1608Metric  [R_0603_1608Metric]  (hidden comment: 1K)
R129  Manufacturer Part Number: FRC0603J103TS  Manufacturer: FOJAN  Package: R_0603  Footprint: Resistor_SMD:R_0603_1608Metric  [R_0603_1608Metric]  (hidden comment: 10K)
R130  Manufacturer Part Number: FRC0603J103TS  Manufacturer: FOJAN  Package: R_0603  Footprint: Resistor_SMD:R_0603_1608Metric  [R_0603_1608Metric]  (hidden comment: 10K)
R131  Manufacturer Part Number: RC0603JR-071KL  Manufacturer: YAGEO  Package: R_0603  Footprint: Resistor_SMD:R_0603_1608Metric  [R_0603_1608Metric]  (hidden comment: 1K)
R132  Manufacturer Part Number: RC0603JR-071KL  Manufacturer: YAGEO  Package: R_0603  Footprint: Resistor_SMD:R_0603_1608Metric  [R_0603_1608Metric]  (hidden comment: 1K)
R133  Manufacturer Part Number: FRC0603J103TS  Manufacturer: FOJAN  Package: R_0603  Footprint: Resistor_SMD:R_0603_1608Metric  [R_0603_1608Metric]  (hidden comment: 10K)
R134  Manufacturer Part Number: FRC0603J103TS  Manufacturer: FOJAN  Package: R_0603  Footprint: Resistor_SMD:R_0603_1608Metric  [R_0603_1608Metric]  (hidden comment: 10K)
R135  Manufacturer Part Number: RC0603JR-071KL  Manufacturer: YAGEO  Package: R_0603  Footprint: Resistor_SMD:R_0603_1608Metric  [R_0603_1608Metric]  (hidden comment: 1K)
R136  Manufacturer Part Number: RC0603JR-071KL  Manufacturer: YAGEO  Package: R_0603  Footprint: Resistor_SMD:R_0603_1608Metric  [R_0603_1608Metric]  (hidden comment: 1K)
R137  Manufacturer Part Number: FRC0603J103TS  Manufacturer: FOJAN  Package: R_0603  Footprint: Resistor_SMD:R_0603_1608Metric  [R_0603_1608Metric]  (hidden comment: 10K)
R138  Manufacturer Part Number: FRC0603J103TS  Manufacturer: FOJAN  Package: R_0603  Footprint: Resistor_SMD:R_0603_1608Metric  [R_0603_1608Metric]  (hidden comment: 10K)
R139  Manufacturer Part Number: RC0603JR-071KL  Manufacturer: YAGEO  Package: R_0603  Footprint: Resistor_SMD:R_0603_1608Metric  [R_0603_1608Metric]  (hidden comment: 1K)
R140  Manufacturer Part Number: RC0603JR-071KL  Manufacturer: YAGEO  Package: R_0603  Footprint: Resistor_SMD:R_0603_1608Metric  [R_0603_1608Metric]  (hidden comment: 1K)
R141  Manufacturer Part Number: FRC0603J103TS  Manufacturer: FOJAN  Package: R_0603  Footprint: Resistor_SMD:R_0603_1608Metric  [R_0603_1608Metric]  (hidden comment: 10K)
R142  Manufacturer Part Number: FRC0603J103TS  Manufacturer: FOJAN  Package: R_0603  Footprint: Resistor_SMD:R_0603_1608Metric  [R_0603_1608Metric]  (hidden comment: 10K)
R143  Manufacturer Part Number: RC0603JR-071KL  Manufacturer: YAGEO  Package: R_0603  Footprint: Resistor_SMD:R_0603_1608Metric  [R_0603_1608Metric]  (hidden comment: 1K)
R144  Manufacturer Part Number: RC0603JR-071KL  Manufacturer: YAGEO  Package: R_0603  Footprint: Resistor_SMD:R_0603_1608Metric  [R_0603_1608Metric]  (hidden comment: 1K)
R145  Manufacturer Part Number: FRC0603J103TS  Manufacturer: FOJAN  Package: R_0603  Footprint: Resistor_SMD:R_0603_1608Metric  [R_0603_1608Metric]  (hidden comment: 10K)
R146  Manufacturer Part Number: FRC0603J103TS  Manufacturer: FOJAN  Package: R_0603  Footprint: Resistor_SMD:R_0603_1608Metric  [R_0603_1608Metric]  (hidden comment: 10K)
R147  Manufacturer Part Number: RC0603JR-071KL  Manufacturer: YAGEO  Package: R_0603  Footprint: Resistor_SMD:R_0603_1608Metric  [R_0603_1608Metric]  (hidden comment: 1K)
R148  Manufacturer Part Number: RC0603JR-071KL  Manufacturer: YAGEO  Package: R_0603  Footprint: Resistor_SMD:R_0603_1608Metric  [R_0603_1608Metric]  (hidden comment: 1K)
R149  Manufacturer Part Number: FRC0603J103TS  Manufacturer: FOJAN  Package: R_0603  Footprint: Resistor_SMD:R_0603_1608Metric  [R_0603_1608Metric]  (hidden comment: 10K)
R150  Manufacturer Part Number: FRC0603J103TS  Manufacturer: FOJAN  Package: R_0603  Footprint: Resistor_SMD:R_0603_1608Metric  [R_0603_1608Metric]  (hidden comment: 10K)
R151  Manufacturer Part Number: RC0603JR-071KL  Manufacturer: YAGEO  Package: R_0603  Footprint: Resistor_SMD:R_0603_1608Metric  [R_0603_1608Metric]  (hidden comment: 1K)
R152  Manufacturer Part Number: RC0603JR-071KL  Manufacturer: YAGEO  Package: R_0603  Footprint: Resistor_SMD:R_0603_1608Metric  [R_0603_1608Metric]  (hidden comment: 1K)
R153  Manufacturer Part Number: FRC0603J103TS  Manufacturer: FOJAN  Package: R_0603  Footprint: Resistor_SMD:R_0603_1608Metric  [R_0603_1608Metric]  (hidden comment: 10K)
R154  Manufacturer Part Number: FRC0603J103TS  Manufacturer: FOJAN  Package: R_0603  Footprint: Resistor_SMD:R_0603_1608Metric  [R_0603_1608Metric]  (hidden comment: 10K)

## Ports
R1_A1 (in, see KNX-RELAY-24CH_V0.2[3A]), R1_A2 (in, see KNX-RELAY-24CH_V0.2[3A]), R1_COM (in, see KNX-RELAY-24CH_V0.2[2A]), R1_NC (in, see KNX-RELAY-24CH_V0.2[2A]), R1_NO (in, see KNX-RELAY-24CH_V0.2[2A]), R2_A1 (in, see KNX-RELAY-24CH_V0.2[3A]), R2_A2 (in, see KNX-RELAY-24CH_V0.2[3A]), R2_COM (in, see KNX-RELAY-24CH_V0.2[2A]), R2_NC (in, see KNX-RELAY-24CH_V0.2[2A]), R2_NO (in, see KNX-RELAY-24CH_V0.2[2A]), R3_A1 (in, see KNX-RELAY-24CH_V0.2[3A]), R3_A2 (in, see KNX-RELAY-24CH_V0.2[3A]), R3_COM (in, see KNX-RELAY-24CH_V0.2[2A]), R3_NC (in, see KNX-RELAY-24CH_V0.2[2A]), R3_NO (in, see KNX-RELAY-24CH_V0.2[2A]), R4_A1 (in, see KNX-RELAY-24CH_V0.2[3A]), R4_A2 (in, see KNX-RELAY-24CH_V0.2[3A]), R4_COM (in, see KNX-RELAY-24CH_V0.2[2A]), R4_NC (in, see KNX-RELAY-24CH_V0.2[2A]), R4_NO (in, see KNX-RELAY-24CH_V0.2[2A]), R5_A1 (in, see KNX-RELAY-24CH_V0.2[3A]), R5_A2 (in, see KNX-RELAY-24CH_V0.2[3A]), R5_COM (in, see KNX-RELAY-24CH_V0.2[2B]), R5_NC (in, see KNX-RELAY-24CH_V0.2[2B]), R5_NO (in, see KNX-RELAY-24CH_V0.2[2B]), R6_A1 (in, see KNX-RELAY-24CH_V0.2[3A]), R6_A2 (in, see KNX-RELAY-24CH_V0.2[3A]), R6_COM (in, see KNX-RELAY-24CH_V0.2[2B]), R6_NC (in, see KNX-RELAY-24CH_V0.2[2B]), R6_NO (in, see KNX-RELAY-24CH_V0.2[2B]), R7_A1 (in, see KNX-RELAY-24CH_V0.2[3A]), R7_A2 (in, see KNX-RELAY-24CH_V0.2[3B]), R7_COM (in, see KNX-RELAY-24CH_V0.2[2B]), R7_NC (in, see KNX-RELAY-24CH_V0.2[2B]), R7_NO (in, see KNX-RELAY-24CH_V0.2[2B]), R8_A1 (in, see KNX-RELAY-24CH_V0.2[3B]), R8_A2 (in, see KNX-RELAY-24CH_V0.2[3B]), R8_COM (in, see KNX-RELAY-24CH_V0.2[2B]), R8_NC (in, see KNX-RELAY-24CH_V0.2[2B]), R8_NO (in, see KNX-RELAY-24CH_V0.2[2B]), R9_A1 (in, see KNX-RELAY-24CH_V0.2[3B]), R9_A2 (in, see KNX-RELAY-24CH_V0.2[3B]), R9_COM (in, see KNX-RELAY-24CH_V0.2[2B]), R9_NC (in, see KNX-RELAY-24CH_V0.2[2B]), R9_NO (in, see KNX-RELAY-24CH_V0.2[2B]), R10_A1 (in, see KNX-RELAY-24CH_V0.2[3B]), R10_A2 (in, see KNX-RELAY-24CH_V0.2[3B]), R10_COM (in, see KNX-RELAY-24CH_V0.2[2B]), R10_NC (in, see KNX-RELAY-24CH_V0.2[2B]), R10_NO (in, see KNX-RELAY-24CH_V0.2[2B]), R11_A1 (in, see KNX-RELAY-24CH_V0.2[3B]), R11_A2 (in, see KNX-RELAY-24CH_V0.2[3B]), R11_COM (in, see KNX-RELAY-24CH_V0.2[2C]), R11_NC (in, see KNX-RELAY-24CH_V0.2[2C]), R11_NO (in, see KNX-RELAY-24CH_V0.2[2C]), R12_A1 (in, see KNX-RELAY-24CH_V0.2[3B]), R12_A2 (in, see KNX-RELAY-24CH_V0.2[3B]), R12_COM (in, see KNX-RELAY-24CH_V0.2[2C]), R12_NC (in, see KNX-RELAY-24CH_V0.2[2C]), R12_NO (in, see KNX-RELAY-24CH_V0.2[2C]), R13_A1 (in, see KNX-RELAY-24CH_V0.2[3B]), R13_A2 (in, see KNX-RELAY-24CH_V0.2[3B]), R13_COM (in, see KNX-RELAY-24CH_V0.2[2C]), R13_NC (in, see KNX-RELAY-24CH_V0.2[2C]), R13_NO (in, see KNX-RELAY-24CH_V0.2[2C]), R14_A1 (in, see KNX-RELAY-24CH_V0.2[3B]), R14_A2 (in, see KNX-RELAY-24CH_V0.2[3B]), R14_COM (in, see KNX-RELAY-24CH_V0.2[2C]), R14_NC (in, see KNX-RELAY-24CH_V0.2[2C]), R14_NO (in, see KNX-RELAY-24CH_V0.2[2C]), R15_A1 (in, see KNX-RELAY-24CH_V0.2[3B]), R15_A2 (in, see KNX-RELAY-24CH_V0.2[3B]), R15_COM (in, see KNX-RELAY-24CH_V0.2[2C]), R15_NC (in, see KNX-RELAY-24CH_V0.2[2C]), R15_NO (in, see KNX-RELAY-24CH_V0.2[2C]), R16_A1 (in, see KNX-RELAY-24CH_V0.2[3C]), R16_A2 (in, see KNX-RELAY-24CH_V0.2[3C]), R16_COM (in, see KNX-RELAY-24CH_V0.2[2C]), R16_NC (in, see KNX-RELAY-24CH_V0.2[2C]), R16_NO (in, see KNX-RELAY-24CH_V0.2[2C]), R17_A1 (in, see KNX-RELAY-24CH_V0.2[3C]), R17_A2 (in, see KNX-RELAY-24CH_V0.2[3C]), R17_COM (in, see KNX-RELAY-24CH_V0.2[2D]), R17_NC (in, see KNX-RELAY-24CH_V0.2[2D]), R17_NO (in, see KNX-RELAY-24CH_V0.2[2D]), R18_A1 (in, see KNX-RELAY-24CH_V0.2[3C]), R18_A2 (in, see KNX-RELAY-24CH_V0.2[3C]), R18_COM (in, see KNX-RELAY-24CH_V0.2[2D]), R18_NC (in, see KNX-RELAY-24CH_V0.2[2D]), R18_NO (in, see KNX-RELAY-24CH_V0.2[2D]), R19_A1 (in, see KNX-RELAY-24CH_V0.2[3C]), R19_A2 (in, see KNX-RELAY-24CH_V0.2[3C]), R19_COM (in, see KNX-RELAY-24CH_V0.2[2D]), R19_NC (in, see KNX-RELAY-24CH_V0.2[2D]), R19_NO (in, see KNX-RELAY-24CH_V0.2[2D]), R20_A1 (in, see KNX-RELAY-24CH_V0.2[3C]), R20_A2 (in, see KNX-RELAY-24CH_V0.2[3C]), R20_COM (in, see KNX-RELAY-24CH_V0.2[2D]), R20_NC (in, see KNX-RELAY-24CH_V0.2[2D]), R20_NO (in, see KNX-RELAY-24CH_V0.2[2D]), R21_A1 (in, see KNX-RELAY-24CH_V0.2[3C]), R21_A2 (in, see KNX-RELAY-24CH_V0.2[3C]), R21_COM (in, see KNX-RELAY-24CH_V0.2[3D]), R21_NC (in, see KNX-RELAY-24CH_V0.2[3D]), R21_NO (in, see KNX-RELAY-24CH_V0.2[3D]), R22_A1 (in, see KNX-RELAY-24CH_V0.2[3C]), R22_A2 (in, see KNX-RELAY-24CH_V0.2[3C]), R22_COM (in, see KNX-RELAY-24CH_V0.2[3D]), R22_NC (in, see KNX-RELAY-24CH_V0.2[3D]), R22_NO (in, see KNX-RELAY-24CH_V0.2[3D]), R23_A1 (in, see KNX-RELAY-24CH_V0.2[3C]), R23_A2 (in, see KNX-RELAY-24CH_V0.2[3C]), R23_COM (in, see KNX-RELAY-24CH_V0.2[3D]), R23_NC (in, see KNX-RELAY-24CH_V0.2[3D]), R23_NO (in, see KNX-RELAY-24CH_V0.2[3D]), R24_A1 (in, see KNX-RELAY-24CH_V0.2[3C]), R24_A2 (in, see KNX-RELAY-24CH_V0.2[3C]), R24_COM (in, see KNX-RELAY-24CH_V0.2[3D]), R24_NC (in, see KNX-RELAY-24CH_V0.2[3D]), R24_NO (in, see KNX-RELAY-24CH_V0.2[3D])

## Nets
+12V: K1.A3 K4.A3 K5.A3 K6.A3 K7.A3 K8.A3 K9.A3 K10.A3 K11.A3 K12.A3 K13.A3 K14.A3 K15.A3 K16.A3 K17.A3 K18.A3 K19.A3 K20.A3 K21.A3 K22.A3 K23.A3 K24.A3 K25.A3 K26.A3
GND: C6.1 C7.1 C12.1 C13.1 C14.1 C15.1 C16.1 C17.1 C18.1 C19.1 C20.1 C21.1 C22.1 C23.1 C24.1 C25.1 C26.1 C27.1 C28.1 C29.1 C30.1 C31.1 C32.1 C37.1 C38.1 C39.1 C40.1 C41.1 C42.1 C43.1 C44.1 C45.1 C46.1 C47.1 C48.1 C49.1 C50.1 C51.1 C52.1 C53.1 C54.1 C55.1 C56.1 C57.1 C58.1 C59.1 C60.1 C61.1 Q3.2(S) Q4.2(S) Q18.2(S) Q19.2(S) Q20.2(S) Q21.2(S) Q22.2(S) Q23.2(S) Q24.2(S) Q25.2(S) Q26.2(S) Q27.2(S) Q28.2(S) Q29.2(S) Q30.2(S) Q31.2(S) Q33.2(S) Q34.2(S) Q35.2(S) Q36.2(S) Q37.2(S) Q38.2(S) Q39.2(S) Q40.2(S) Q41.2(S) Q42.2(S) Q43.2(S) Q44.2(S) Q45.2(S) Q46.2(S) Q47.2(S) Q48.2(S) Q49.2(S) Q50.2(S) Q51.2(S) Q52.2(S) Q53.2(S) Q54.2(S) Q55.2(S) Q56.2(S) Q57.2(S) Q58.2(S) Q59.2(S) Q60.2(S) Q61.2(S) Q62.2(S) Q63.2(S) Q64.2(S) R32.1 R35.1 R58.1 R59.1 R62.1 R63.1 R66.1 R67.1 R70.1 R71.1 R74.1 R75.1 R78.1 R79.1 R82.1 R83.1 R95.1 R96.1 R97.1 R98.1 R101.1 R102.1 R105.1 R106.1 R109.1 R110.1 R113.1 R114.1 R117.1 R118.1 R121.1 R122.1 R125.1 R126.1 R129.1 R130.1 R133.1 R134.1 R137.1 R138.1 R141.1 R142.1 R145.1 R146.1 R149.1 R150.1 R153.1 R154.1
R1_A1: R34.2 ; port R1_A1
R1_A2: R33.2 ; port R1_A2
R1_COM: K1.11 ; port R1_COM
R1_NC: K1.12 ; port R1_NC
R1_NO: K1.14 ; port R1_NO
R2_A1: R57.2 ; port R2_A1
R2_A2: R56.2 ; port R2_A2
R2_COM: K4.11 ; port R2_COM
R2_NC: K4.12 ; port R2_NC
R2_NO: K4.14 ; port R2_NO
R3_A1: R61.2 ; port R3_A1
R3_A2: R60.2 ; port R3_A2
R3_COM: K5.11 ; port R3_COM
R3_NC: K5.12 ; port R3_NC
R3_NO: K5.14 ; port R3_NO
R4_A1: R65.2 ; port R4_A1
R4_A2: R64.2 ; port R4_A2
R4_COM: K6.11 ; port R4_COM
R4_NC: K6.12 ; port R4_NC
R4_NO: K6.14 ; port R4_NO
R5_A1: R69.2 ; port R5_A1
R5_A2: R68.2 ; port R5_A2
R5_COM: K7.11 ; port R5_COM
R5_NC: K7.12 ; port R5_NC
R5_NO: K7.14 ; port R5_NO
R6_A1: R73.2 ; port R6_A1
R6_A2: R72.2 ; port R6_A2
R6_COM: K8.11 ; port R6_COM
R6_NC: K8.12 ; port R6_NC
R6_NO: K8.14 ; port R6_NO
R7_A1: R77.2 ; port R7_A1
R7_A2: R76.2 ; port R7_A2
R7_COM: K9.11 ; port R7_COM
R7_NC: K9.12 ; port R7_NC
R7_NO: K9.14 ; port R7_NO
R8_A1: R81.2 ; port R8_A1
R8_A2: R80.2 ; port R8_A2
R8_COM: K10.11 ; port R8_COM
R8_NC: K10.12 ; port R8_NC
R8_NO: K10.14 ; port R8_NO
R9_A1: R93.2 ; port R9_A1
R9_A2: R91.2 ; port R9_A2
R9_COM: K11.11 ; port R9_COM
R9_NC: K11.12 ; port R9_NC
R9_NO: K11.14 ; port R9_NO
R10_A1: R94.2 ; port R10_A1
R10_A2: R92.2 ; port R10_A2
R10_COM: K12.11 ; port R10_COM
R10_NC: K12.12 ; port R10_NC
R10_NO: K12.14 ; port R10_NO
R11_A1: R100.2 ; port R11_A1
R11_A2: R99.2 ; port R11_A2
R11_COM: K13.11 ; port R11_COM
R11_NC: K13.12 ; port R11_NC
R11_NO: K13.14 ; port R11_NO
R12_A1: R104.2 ; port R12_A1
R12_A2: R103.2 ; port R12_A2
R12_COM: K14.11 ; port R12_COM
R12_NC: K14.12 ; port R12_NC
R12_NO: K14.14 ; port R12_NO
R13_A1: R108.2 ; port R13_A1
R13_A2: R107.2 ; port R13_A2
R13_COM: K15.11 ; port R13_COM
R13_NC: K15.12 ; port R13_NC
R13_NO: K15.14 ; port R13_NO
R14_A1: R112.2 ; port R14_A1
R14_A2: R111.2 ; port R14_A2
R14_COM: K16.11 ; port R14_COM
R14_NC: K16.12 ; port R14_NC
R14_NO: K16.14 ; port R14_NO
R15_A1: R116.2 ; port R15_A1
R15_A2: R115.2 ; port R15_A2
R15_COM: K17.11 ; port R15_COM
R15_NC: K17.12 ; port R15_NC
R15_NO: K17.14 ; port R15_NO
R16_A1: R120.2 ; port R16_A1
R16_A2: R119.2 ; port R16_A2
R16_COM: K18.11 ; port R16_COM
R16_NC: K18.12 ; port R16_NC
R16_NO: K18.14 ; port R16_NO
R17_A1: R124.2 ; port R17_A1
R17_A2: R123.2 ; port R17_A2
R17_COM: K19.11 ; port R17_COM
R17_NC: K19.12 ; port R17_NC
R17_NO: K19.14 ; port R17_NO
R18_A1: R128.2 ; port R18_A1
R18_A2: R127.2 ; port R18_A2
R18_COM: K20.11 ; port R18_COM
R18_NC: K20.12 ; port R18_NC
R18_NO: K20.14 ; port R18_NO
R19_A1: R132.2 ; port R19_A1
R19_A2: R131.2 ; port R19_A2
R19_COM: K21.11 ; port R19_COM
R19_NC: K21.12 ; port R19_NC
R19_NO: K21.14 ; port R19_NO
R20_A1: R136.2 ; port R20_A1
R20_A2: R135.2 ; port R20_A2
R20_COM: K22.11 ; port R20_COM
R20_NC: K22.12 ; port R20_NC
R20_NO: K22.14 ; port R20_NO
R21_A1: R140.2 ; port R21_A1
R21_A2: R139.2 ; port R21_A2
R21_COM: K23.11 ; port R21_COM
R21_NC: K23.12 ; port R21_NC
R21_NO: K23.14 ; port R21_NO
R22_A1: R144.2 ; port R22_A1
R22_A2: R143.2 ; port R22_A2
R22_COM: K24.11 ; port R22_COM
R22_NC: K24.12 ; port R22_NC
R22_NO: K24.14 ; port R22_NO
R23_A1: R148.2 ; port R23_A1
R23_A2: R147.2 ; port R23_A2
R23_COM: K25.11 ; port R23_COM
R23_NC: K25.12 ; port R23_NC
R23_NO: K25.14 ; port R23_NO
R24_A1: R152.2 ; port R24_A1
R24_A2: R151.2 ; port R24_A2
R24_COM: K26.11 ; port R24_COM
R24_NC: K26.12 ; port R24_NC
R24_NO: K26.14 ; port R24_NO
NetC6_2: C6.2 Q3.1(G) R32.2 R33.1
NetC7_2: C7.2 Q4.1(G) R34.1 R35.2
NetC12_2: C12.2 Q18.1(G) R57.1 R58.2
NetC13_2: C13.2 Q19.1(G) R56.1 R59.2
NetC14_2: C14.2 Q20.1(G) R61.1 R62.2
NetC15_2: C15.2 Q21.1(G) R60.1 R63.2
NetC16_2: C16.2 Q22.1(G) R65.1 R66.2
NetC17_2: C17.2 Q23.1(G) R64.1 R67.2
NetC18_2: C18.2 Q24.1(G) R69.1 R70.2
NetC19_2: C19.2 Q25.1(G) R68.1 R71.2
NetC20_2: C20.2 Q26.1(G) R73.1 R74.2
NetC21_2: C21.2 Q27.1(G) R72.1 R75.2
NetC22_2: C22.2 Q28.1(G) R77.1 R78.2
NetC23_2: C23.2 Q29.1(G) R76.1 R79.2
NetC24_2: C24.2 Q30.1(G) R81.1 R82.2
NetC25_2: C25.2 Q31.1(G) R80.1 R83.2
NetC26_2: C26.2 Q33.1(G) R93.1 R95.2
NetC27_2: C27.2 Q34.1(G) R94.1 R97.2
NetC28_2: C28.2 Q35.1(G) R91.1 R96.2
NetC29_2: C29.2 Q36.1(G) R92.1 R98.2
NetC30_2: C30.2 Q37.1(G) R100.1 R101.2
NetC31_2: C31.2 Q38.1(G) R99.1 R102.2
NetC32_2: C32.2 Q39.1(G) R104.1 R105.2
NetC37_2: C37.2 Q40.1(G) R103.1 R106.2
NetC38_2: C38.2 Q41.1(G) R108.1 R109.2
NetC39_2: C39.2 Q42.1(G) R107.1 R110.2
NetC40_2: C40.2 Q43.1(G) R112.1 R113.2
NetC41_2: C41.2 Q44.1(G) R111.1 R114.2
NetC42_2: C42.2 Q45.1(G) R116.1 R117.2
NetC43_2: C43.2 Q46.1(G) R115.1 R118.2
NetC44_2: C44.2 Q47.1(G) R120.1 R121.2
NetC45_2: C45.2 Q48.1(G) R119.1 R122.2
NetC46_2: C46.2 Q49.1(G) R124.1 R125.2
NetC47_2: C47.2 Q50.1(G) R123.1 R126.2
NetC48_2: C48.2 Q51.1(G) R128.1 R129.2
NetC49_2: C49.2 Q52.1(G) R127.1 R130.2
NetC50_2: C50.2 Q53.1(G) R132.1 R133.2
NetC51_2: C51.2 Q54.1(G) R131.1 R134.2
NetC52_2: C52.2 Q55.1(G) R136.1 R137.2
NetC53_2: C53.2 Q56.1(G) R135.1 R138.2
NetC54_2: C54.2 Q57.1(G) R140.1 R141.2
NetC55_2: C55.2 Q58.1(G) R139.1 R142.2
NetC56_2: C56.2 Q59.1(G) R144.1 R145.2
NetC57_2: C57.2 Q60.1(G) R143.1 R146.2
NetC58_2: C58.2 Q61.1(G) R148.1 R149.2
NetC59_2: C59.2 Q62.1(G) R147.1 R150.2
NetC60_2: C60.2 Q63.1(G) R152.1 R153.2
NetC61_2: C61.2 Q64.1(G) R151.1 R154.2
NetK1_A1: K1.A1 Q4.3(D)
NetK1_A2: K1.A2 Q3.3(D)
NetK4_A1: K4.A1 Q18.3(D)
NetK4_A2: K4.A2 Q19.3(D)
NetK5_A1: K5.A1 Q20.3(D)
NetK5_A2: K5.A2 Q21.3(D)
NetK6_A1: K6.A1 Q22.3(D)
NetK6_A2: K6.A2 Q23.3(D)
NetK7_A1: K7.A1 Q24.3(D)
NetK7_A2: K7.A2 Q25.3(D)
NetK8_A1: K8.A1 Q26.3(D)
NetK8_A2: K8.A2 Q27.3(D)
NetK9_A1: K9.A1 Q28.3(D)
NetK9_A2: K9.A2 Q29.3(D)
NetK10_A1: K10.A1 Q30.3(D)
NetK10_A2: K10.A2 Q31.3(D)
NetK11_A1: K11.A1 Q33.3(D)
NetK11_A2: K11.A2 Q35.3(D)
NetK12_A1: K12.A1 Q34.3(D)
NetK12_A2: K12.A2 Q36.3(D)
NetK13_A1: K13.A1 Q37.3(D)
NetK13_A2: K13.A2 Q38.3(D)
NetK14_A1: K14.A1 Q39.3(D)
NetK14_A2: K14.A2 Q40.3(D)
NetK15_A1: K15.A1 Q41.3(D)
NetK15_A2: K15.A2 Q42.3(D)
NetK16_A1: K16.A1 Q43.3(D)
NetK16_A2: K16.A2 Q44.3(D)
NetK17_A1: K17.A1 Q45.3(D)
NetK17_A2: K17.A2 Q46.3(D)
NetK18_A1: K18.A1 Q47.3(D)
NetK18_A2: K18.A2 Q48.3(D)
NetK19_A1: K19.A1 Q49.3(D)
NetK19_A2: K19.A2 Q50.3(D)
NetK20_A1: K20.A1 Q51.3(D)
NetK20_A2: K20.A2 Q52.3(D)
NetK21_A1: K21.A1 Q53.3(D)
NetK21_A2: K21.A2 Q54.3(D)
NetK22_A1: K22.A1 Q55.3(D)
NetK22_A2: K22.A2 Q56.3(D)
NetK23_A1: K23.A1 Q57.3(D)
NetK23_A2: K23.A2 Q58.3(D)
NetK24_A1: K24.A1 Q59.3(D)
NetK24_A2: K24.A2 Q60.3(D)
NetK25_A1: K25.A1 Q61.3(D)
NetK25_A2: K25.A2 Q62.3(D)
NetK26_A1: K26.A1 Q63.3(D)
NetK26_A2: K26.A2 Q64.3(D)

## Notes on the sheet
- 1
- 2
- 3
- 4
- 5
- 6
- 7
- 8
- 9
- 10
- 11
- A
- B
- C
- D
- E
- F
- G
- H
- Title:
- File: RELAYS.kicad_sch
- Sheet: /
- KiCad E.D.A.  kicad (5.1.4)-1
- Size: A2
- Date:
- Rev:
- Id: 1/1
- (in symbol RT314A03) +

## Library data of the parts
C6 C7 C12-C32 C37-C61 = C_3: Value: 100nF
K1 K4-K26 = RT314A03: Manufacturer Part Number: RT314F12; Value: RT314F12
Q3 Q4 Q18-Q31 Q33-Q64 = Q_NMOS_Depletion_GSD: Manufacturer Part Number: 2N7002ET1G; Package: SOT-23; Value: 2N7002ET1G
R32-R35 R56-R83 R91-R154 = R_US
  R32 R35 R58 R59 R62 R63 R66 R67 R70 R71 R74 R75 R78 R79 R82 R83 R95-R98 R101 R102 R105 R106 R109 R110 R113 R114 R117 R118 R121 R122 R125 R126 R129 R130 R133 R134 R137 R138 R141 R142 R145 R146 R149 R150 R153 R154: Value: 10K
  R33 R34 R56 R57 R60 R61 R64 R65 R68 R69 R72 R73 R76 R77 R80 R81 R91-R94 R99 R100 R103 R104 R107 R108 R111 R112 R115 R116 R119 R120 R123 R124 R127 R128 R131 R132 R135 R136 R139 R140 R143 R144 R147 R148 R151 R152: Value: 1K